# Altium schematic sheet wifi.SchDoc
size A
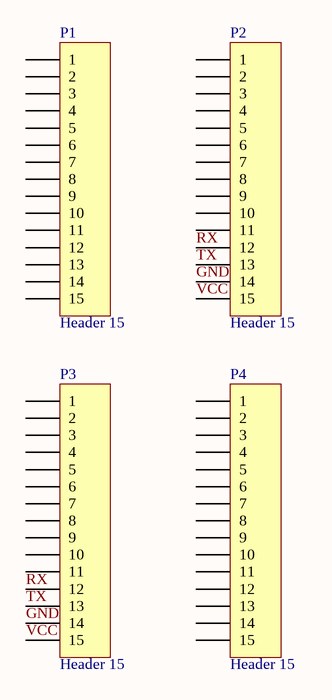
[diagram p0: wifi.SchDoc]

## Parts
P1  Header 15  [HDR1X15]
P2  Header 15  [HDR1X15]
P3  Header 15  [HDR1X15]
P4  Header 15  [HDR1X15]

## Nets
GND: P2.14 P3.14
RX: P2.12 P3.12
TX: P2.13 P3.13
VCC: P2.15 P3.15

Not connected (* = marked no-connect by the designer): P1 1 2 3 4 5 6 7 8 9 10 11 12 13 14 15; P2 1 2 3 4 5 6 7 8 9 10 11; P3 1 2 3 4 5 6 7 8 9 10 11; P4 1 2 3 4 5 6 7 8 9 10 11 12 13 14 15

## Library data of the parts
P1-P4 = Header 15: Header, 15-Pin; LatestRevisionDate: 17-Jul-2002; LatestRevisionNote: Re-released for DXP Platform.; Publisher: Altium Limited